# EAGLE design main_board (EAGLE 9.2.1)

## Sheet 1 of 2: POWER
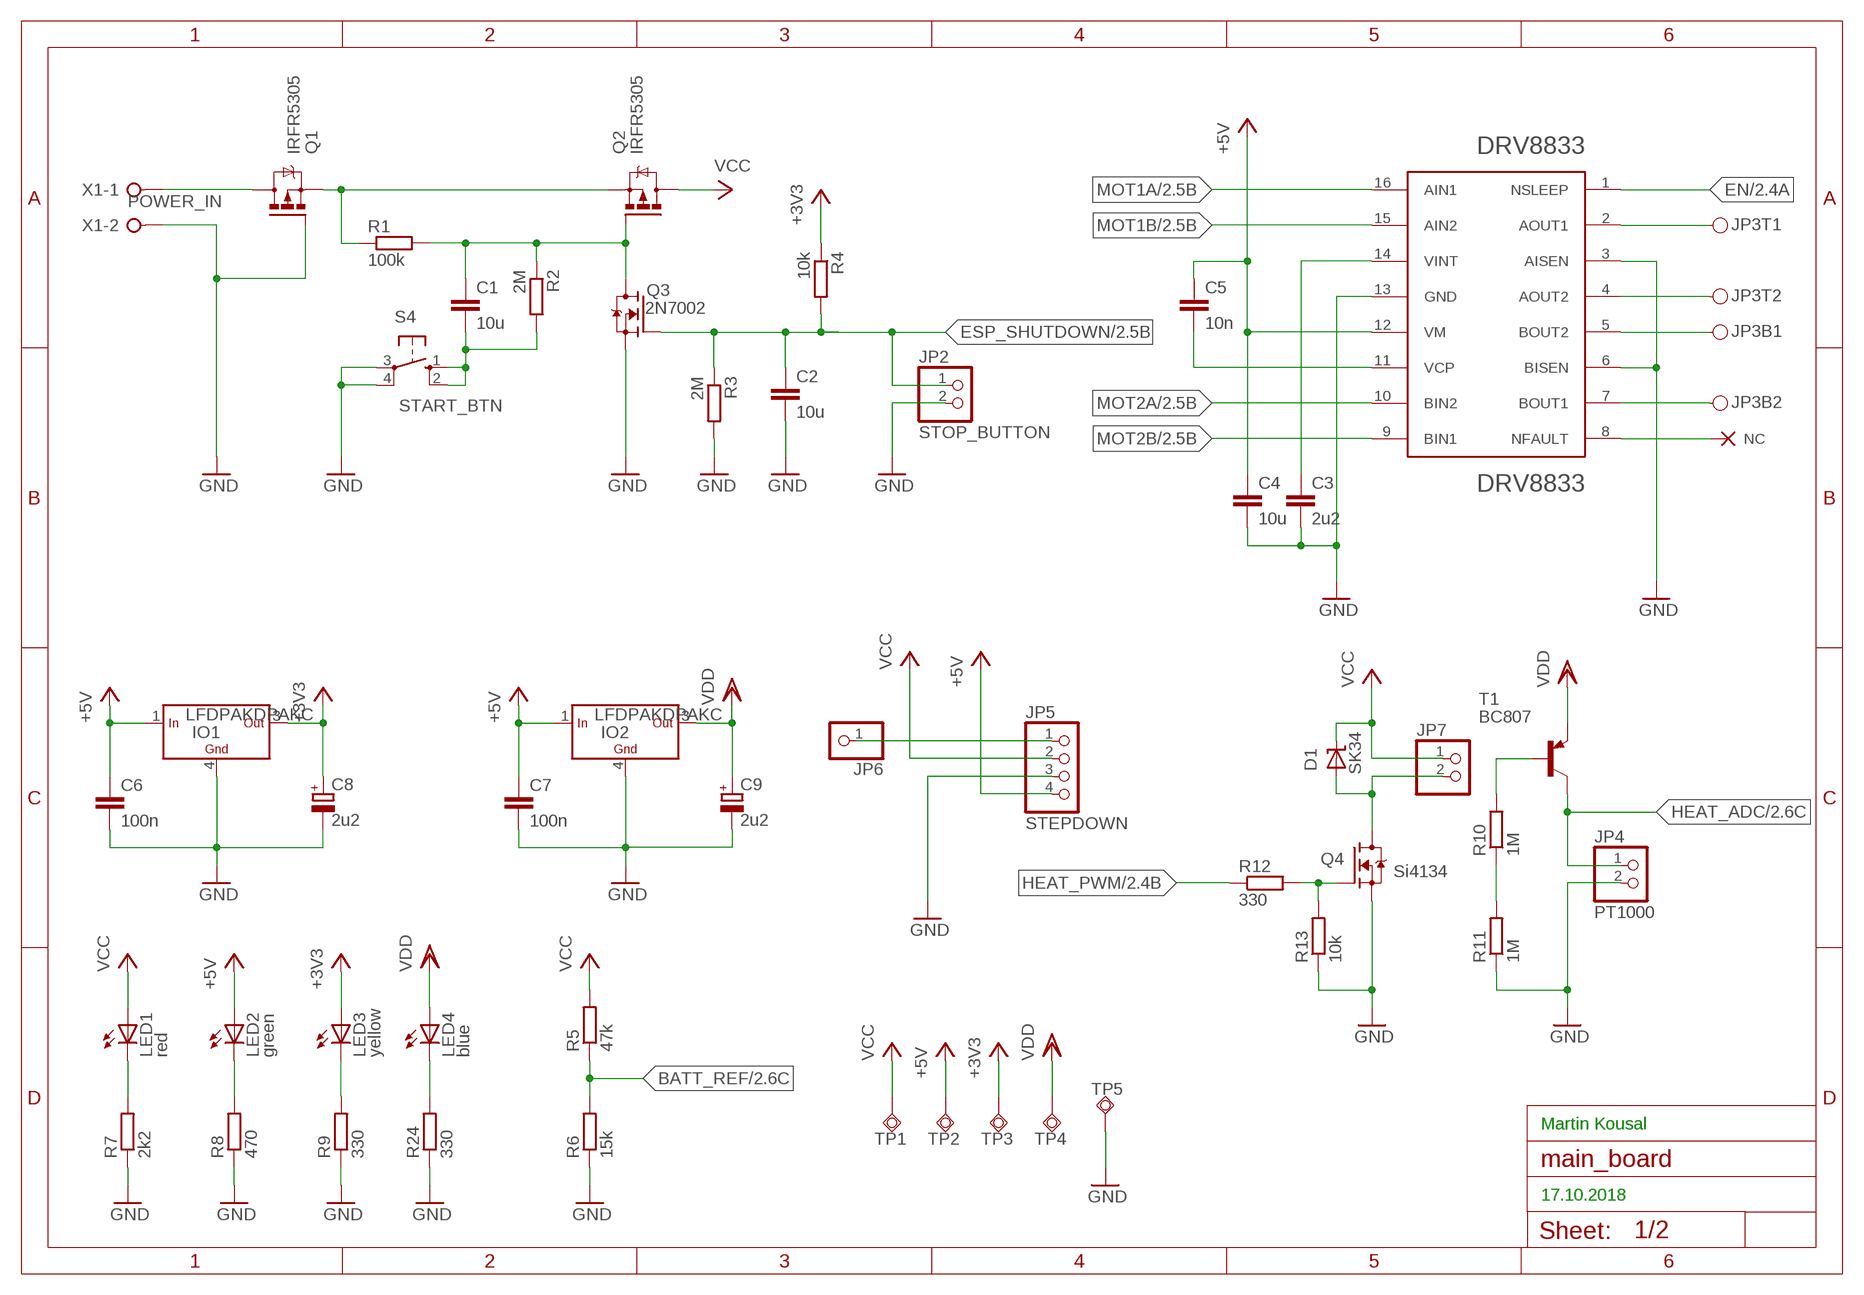
[diagram p0: schematic, sheet 1]

### Parts
C1  10u  C-EUC0805  [C0805]
C2  10u  C-EUC0805  [C0805]
C3  2u2  C-EUC0603  [C0603]
C4  10u  C-EUC1206  [C1206]
C5  10n  C-EUC0603  [C0603]
C6  100n  C-EUC0603  [C0603]
C7  100n  C-EUC0603  [C0603]
C8  2u2  CPOL-EUUD-4X5,8  [UD-4X5,8_NICHICON]
C9  2u2  CPOL-EUUD-4X5,8  [UD-4X5,8_NICHICON]
D1  SK34  SHOTTKY-SMB  [SMB]
DRV8833PWP1  DRV8833  [SOP65P640X120-17N]
IO1  LFDPAKDPAKC  [DPAK]
IO2  LFDPAKDPAKC  [DPAK]
JP2  STOP_BUTTON  PINHD-1X2  [1X02]
JP3  PINH2X02  [PINH2X02SMD]
JP4  PT1000  PINHD-1X2  [1X02]
JP5  STEPDOWN  PINHD-1X4  [1X04]
JP6  PINHD-1X1  [1X01]
JP7  PINHD-1X2  [1X02]
LED1  red  LEDCHIP-LED0603  [CHIP-LED0603]
LED2  green  LEDCHIP-LED0603  [CHIP-LED0603]
LED3  yellow  LEDCHIP-LED0603  [CHIP-LED0603]
LED4  blue  LEDCHIP-LED0603  [CHIP-LED0603]
NC1  NC  (no package)
Q1  IRFR5305  [D-PAK_TO252AA]
Q2  IRFR5305  [D-PAK_TO252AA]
Q3  2N7002  N-MOSFET-SOT23-GSD  [SOT23]
Q4  Si4134  N-MOSFET-SO8  [SO-8]
R1  100k  R-EU_R0603  [R0603]
R2  2M  R-EU_R0603  [R0603]
R3  2M  R-EU_R0603  [R0603]
R4  10k  R-EU_R0603  [R0603]
R5  47k  R-EU_R0603  [R0603]
R6  15k  R-EU_R0603  [R0603]
R7  2k2  R-EU_R0603  [R0603]
R8  470  R-EU_R0603  [R0603]
R9  330  R-EU_R0603  [R0603]
R10  1M  R-EU_R0603  [R0603]
R11  1M  R-EU_R0603  [R0603]
R12  330  R-EU_R0603  [R0603]
R13  10k  R-EU_R0603  [R0603]
R24  330  R-EU_R0603  [R0603]
S4  START_BTN  10-XX  [B3F-10XX]
T1  BC807  BC807-25-PNP-SOT23-BEC  [SOT23-BEC]
TP1  TPSQTP20SQ  [TP20SQ]
TP2  TPSQTP20SQ  [TP20SQ]
TP3  TPSQTP20SQ  [TP20SQ]
TP4  TPSQTP20SQ  [TP20SQ]
TP5  TPSQTP20SQ  [TP20SQ]
X1  POWER_IN  W237-02P  [W237-132]

### Nets
+3V3: C8.+ IO1.3(OUT) LED3.A R4.1 TP3.TP ; also sheet 2
+5V: C4.1 C5.1 C6.1 C7.1 DRV8833PWP1.12(VM) IO1.1(IN) IO2.1(IN) JP5.4 LED2.A TP2.TP
BATT_REF: R5.1 R6.2 ; also sheet 2
EN: DRV8833PWP1.1(NSLEEP) ; also sheet 2
ESP_SHUTDOWN: C2.1 JP2.1 Q3.1(G) R3.1 R4.2 ; also sheet 2
GND: C2.2 C3.2 C4.2 C6.2 C7.2 C8.- C9.- DRV8833PWP1.3(AISEN) DRV8833PWP1.6(BISEN) DRV8833PWP1.13(GND) IO1.4(GND) IO2.4(GND) JP2.2 JP4.2 JP5.3 Q1.1(G) Q3.2(S) Q4.1(S) Q4.2(S) Q4.3(S) R3.2 R6.1 R7.1 R8.1 R9.1 R11.1 R13.1 R24.1 S4.3(P) S4.4(P1) TP5.TP X1.2 ; also sheet 2
HEAT_ADC: JP4.1 T1.C ; also sheet 2
HEAT_PWM: R12.1 ; also sheet 2
MOT1A: DRV8833PWP1.16(AIN1) ; also sheet 2
MOT1B: DRV8833PWP1.15(AIN2) ; also sheet 2
MOT2A: DRV8833PWP1.10(BIN2) ; also sheet 2
MOT2B: DRV8833PWP1.9(BIN1) ; also sheet 2
N$1: Q1.3(S) Q2.3(S) R1.1
N$2: C1.1 Q2.1(G) Q3.3(D) R1.2 R2.1
N$3: LED4.C R24.2
N$4: Q1.4(D) X1.1
N$5: LED3.C R9.2
N$6: LED2.C R8.2
N$7: LED1.C R7.2
N$8: DRV8833PWP1.2(AOUT1) JP3.T1
N$9: DRV8833PWP1.4(AOUT2) JP3.T2
N$10: DRV8833PWP1.5(BOUT2) JP3.B1
N$11: DRV8833PWP1.7(BOUT1) JP3.B2
N$13: C3.1 DRV8833PWP1.14(VINT)
N$14: JP5.1 JP6.1
N$15: C5.2 DRV8833PWP1.11(VCP)
N$16: D1.A JP7.2 Q4.5(D) Q4.6(D) Q4.7(D) Q4.8(D)
N$17: DRV8833PWP1.8(NFAULT) NC1.NC
N$18: R10.1 R11.2
N$19: R10.2 T1.B
N$22: Q4.4(G) R12.2 R13.2
N$30: C1.2 R2.2 S4.1(S) S4.2(S1)
VCC: D1.C JP5.2 JP7.1 LED1.A Q2.4(D) R5.2 TP1.TP
VDD: C9.+ IO2.3(OUT) LED4.A T1.E TP4.TP ; also sheet 2

### Notes on the sheet
- Martin Kousal
- 17.10.2018

## Sheet 2 of 2: LOGIC
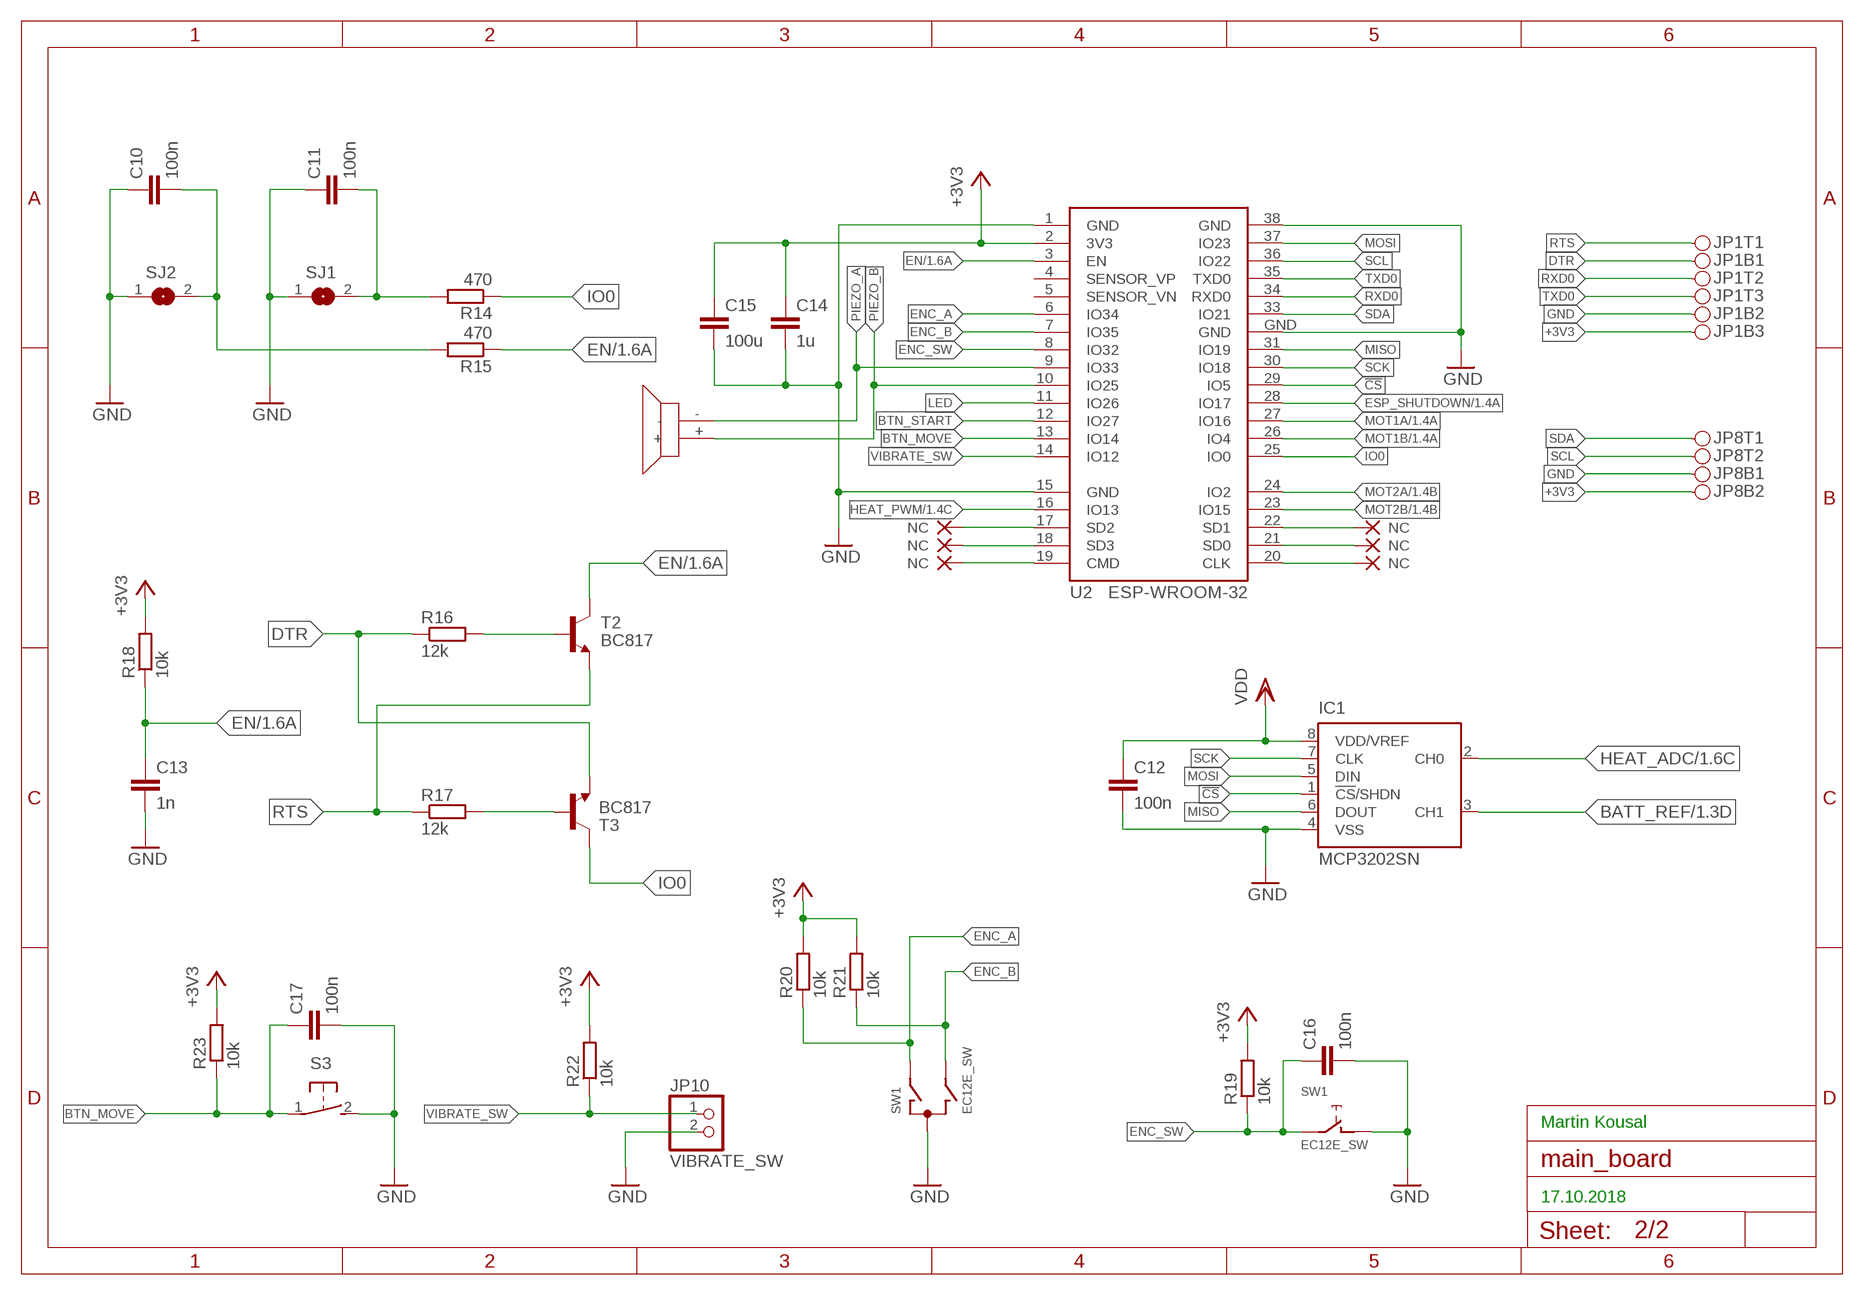
[diagram p1: schematic, sheet 2]

### Parts
C10  100n  C-EUC0603  [C0603]
C11  100n  C-EUC0603  [C0603]
C12  100n  C-EUC0603  [C0603]
C13  1n  C-EUC0603  [C0603]
C14  1u  C-EUC0603  [C0603]
C15  100u  C-EUC0603  [C0603]
C16  100n  C-EUC0603  [C0603]
C17  100n  C-EUC0603  [C0603]
IC1  MCP3202SN  [SO-08]
JP1  PINH2X03  [PINH2X03SMD]
JP8  PINH2X02  [PINH2X02SMD]
JP10  VIBRATE_SW  PINHD-1X2  [1X02]
NC2  NC  (no package)
NC3  NC  (no package)
NC4  NC  (no package)
NC5  NC  (no package)
NC6  NC  (no package)
NC7  NC  (no package)
R14  470  R-EU_R0603  [R0603]
R15  470  R-EU_R0603  [R0603]
R16  12k  R-EU_R0603  [R0603]
R17  12k  R-EU_R0603  [R0603]
R18  10k  R-EU_R0603  [R0603]
R19  10k  R-EU_R0603  [R0603]
R20  10k  R-EU_R0603  [R0603]
R21  10k  R-EU_R0603  [R0603]
R22  10k  R-EU_R0603  [R0603]
R23  10k  R-EU_R0603  [R0603]
S3  31-XX  [B3F-31XX]
SJ1  SJ  [SJ]
SJ2  SJ  [SJ]
SW1  EC12E_SW  [ALPS_EC12E_SW]
T2  BC817  BC817-25-NPN-SOT23-BEC  [SOT23-BEC]
T3  BC817  BC817-25-NPN-SOT23-BEC  [SOT23-BEC]
U2  ESP-WROOM-32  [ESP-WROOM-32]
U$1  PIEZO  [PIEZO]

### Nets
!CS: IC1.1(!CS!/SHDN) U2.29(IO5)
+3V3: C14.1 C15.1 JP1.B3 JP8.B2 R18.2 R19.2 R20.2 R21.2 R22.2 R23.2 U2.2(3V3) ; also sheet 1
BATT_REF: IC1.3(CH1) ; also sheet 1
BTN_MOVE: C17.1 R23.1 S3.1(P) U2.13(IO14)
BTN_START: U2.12(IO27)
DTR: JP1.B1 R16.1 T3.E
EN: C13.1 R15.1 R18.1 T2.C U2.3(EN) ; also sheet 1
ENC_A: R20.1 SW1.A U2.6(IO34)
ENC_B: R21.1 SW1.B U2.7(IO35)
ENC_SW: C16.1 R19.1 SW1.E U2.8(IO32)
ESP_SHUTDOWN: U2.28(IO17) ; also sheet 1
GND: C10.1 C11.1 C12.2 C13.2 C14.2 C15.2 C16.2 C17.2 IC1.4(VSS) JP1.B2 JP8.B1 JP10.2 S3.2(S) SJ1.1 SJ2.1 SW1.C SW1.D U2.1(GND) U2.15(GND) U2.38(GND) U2.GND ; also sheet 1
HEAT_ADC: IC1.2(CH0) ; also sheet 1
HEAT_PWM: U2.16(IO13) ; also sheet 1
IO0: R14.1 T3.C U2.25(IO0)
LED: U2.11(IO26)
MISO: IC1.6(DOUT) U2.31(IO19)
MOSI: IC1.5(DIN) U2.37(IO23)
MOT1A: U2.27(IO16) ; also sheet 1
MOT1B: U2.26(IO4) ; also sheet 1
MOT2A: U2.24(IO2) ; also sheet 1
MOT2B: U2.23(IO15) ; also sheet 1
N$12: R16.2 T2.B
N$20: C10.2 R15.2 SJ2.2
N$21: R17.2 T3.B
N$23: C11.2 R14.2 SJ1.2
N$24: NC5.NC U2.22(SD1)
N$25: NC2.NC U2.17(SD2)
N$26: NC3.NC U2.18(SD3)
N$27: NC4.NC U2.19(CMD)
N$28: NC6.NC U2.21(SD0)
N$29: NC7.NC U2.20(CLK)
PIEZO_A: U2.9(IO33) U$1.-
PIEZO_B: U2.10(IO25) U$1.+
RTS: JP1.T1 R17.1 T2.E
RXD0: JP1.T2 U2.34(RXD0)
SCK: IC1.7(CLK) U2.30(IO18)
SCL: JP8.T2 U2.36(IO22)
SDA: JP8.T1 U2.33(IO21)
TXD0: JP1.T3 U2.35(TXD0)
VDD: C12.1 IC1.8(VDD/VREF) ; also sheet 1
VIBRATE_SW: JP10.1 R22.1 U2.14(IO12)
Unconnected: SW1.GND1(G) SW1.GND2(G) U2.4(SENSOR_VP) U2.5(SENSOR_VN)

### Notes on the sheet
- Martin Kousal
- 17.10.2018

## Library data of the parts
C1-C7 C10-C17 = rcl_upravena:C-EU: CAPACITOR, European symbol
C8 C9 = rcl_upravena:CPOL-EU: POLARIZED CAPACITOR, European symbol
D1 = diode:SHOTTKY
DRV8833PWP1 = DRV8833PWP:DRV8833
IC1 = microchip:MCP3202: 2.7V Dual Channel 12-Bit A/D Converter with SPI Serial Interface Source: http://ww1.microchip.com/downloads/en/DeviceDoc/21034D.pdf; MF: MICROCHIP; MPN: MCP3202-CI/SN; OC_FARNELL: 1196803; OC_NEWARK: 19C7207
IO1 IO2 = #PaJa_30:LF??C: LF??C - stabilizátory low-drop výstup dle typu 1,25 - 12V
JP1 = pinhead_smd:PINH2X03
JP2 JP4 JP7 JP10 = pinhead:PINHD-1X2: PIN HEADER
JP3 JP8 = pinhead_smd:PINH2X02
JP5 = pinhead:PINHD-1X4: PIN HEADER
JP6 = pinhead:PINHD-1X1: PIN HEADER
LED1-LED4 = led:LED: LED OSRAM: - CHIPLED LG R971, LG N971, LY N971, LG Q971, LY Q971, LO R971, LY R971 LH N974, LH R974 LS Q976, LO Q976, LY Q976 LO Q996 - Hyper CHIPLED LW Q18S LB Q993, LB Q99A, LB R99A - SideLED LS A670, LO A670, LY A670, LG A670, LP A670 LB A673, LV A673, LT A673, LW A673 LH A674 LY A675 LS A676, LA A676, LO A676, LY A676, LW A676 LS A679, LY A679, LG A679 - Hyper Micro SIDELED® LS Y876, LA Y876, LO Y876, LY Y876 LT Y87S - SmartLED LW L88C, LW L88S LB L89C, LB L89S, LG L890 LS L89K, LO L89K, LY L89K LS L896, LA L896, LO L896, LY L896 - TOPLED LS T670, LO T670, LY T670, LG T670, LP T670 LSG T670, LSP T670, LSY T670, LOP T670, LYG T670 LG T671, LOG T671, LSG T671 LB T673, LV T673, LT T673, LW T673 LH T674 LS T676, LA T676, LO T676, LY T676, LB T676, LH T676, LSB T676, LW T676 LB T67C, LV T67C, LT T67C, LS T67K, LO T67K, LY T67K, LW E67C LS E67B, LA E67B, LO E67B, LY E67B, LB E67C, LV E67C, LT E67C LW T67C LS T679, LY T679, LG T679 LS T770, LO T770, LY T770, LG T770, LP T770 LB T773, LV T773, LT T773, LW T773 LH T774 LS E675, LA E675, LY E675, LS T675 LS T776, LA T776, LO T776, LY T776, LB T776 LHGB T686 LT T68C, LB T68C - Hyper Mini TOPLED® LB M676 - Mini TOPLED Santana® LG M470 LS M47K, LO M47K, LY M47K Source: http://www.osram.convergy.de LUXEON: - LUMILED® LXK2-PW12-R00, LXK2-PW12-S00, LXK2-PW14-U00, LXK2-PW14-V00 LXK2-PM12-R00, LXK2-PM12-S00, LXK2-PM14-U00 LXK2-PE12-Q00, LXK2-PE12-R00, LXK2-PE12-S00, LXK2-PE14-T00, LXK2-PE14-U00 LXK2-PB12-K00, LXK2-PB12-L00, LXK2-PB12-M00, LXK2-PB14-N00, LXK2-PB14-P00, LXK2-PB14-Q00 LXK2-PR12-L00, LXK2-PR12-M00, LXK2-PR14-Q00, LXK2-PR14-R00 LXK2-PD12-Q00, LXK2-PD12-R00, LXK2-PD12-S00 LXK2-PH12-R00, LXK2-PH12-S00 LXK2-PL12-P00, LXK2-PL12-Q00, LXK2-PL12-R00 Source: www.luxeon.com KINGBRIGHT: KA-3528ASYC Source: www.kingbright.com
NC1-NC7 = NC:NC: _EXTERNAL_
Q1 Q2 = transistor-power:IRF?5305: HEXFET Power MOSFET Source: http://www.irf.com/product-info/datasheets/data/irfr5305pbf.pdf
Q3 Q4 = transistors:N-MOSFET
R1-R24 = rcl_upravena:R-EU_: RESISTOR, European symbol
S3 = switch-omron:31-XX: OMRON SWITCH; MPN: B3F-3100; OC_FARNELL: 959704; OC_NEWARK: 36M3582
S4 = switch-omron:10-XX: OMRON SWITCH; MPN: B3F-1000; OC_FARNELL: 176432; OC_NEWARK: 36M3542
SJ1 SJ2 = jumper:SJ: SMD solder JUMPER
SW1 = switch-alps:EC12E_SW: ALPS rotary Encoder EC12E series with switch; MPN: EC12E2424407; OC_FARNELL: 1520813; OC_NEWARK: 74M1068
T1 = transistor:*-PNP-: PNP Transistror
T2 T3 = transistor:*-NPN-: NPN Transistror BF959 corrected 2008.03.06
TP1-TP5 = testpad:TPSQ: Test pad
U2 = esp32:ESP-WROOM-32: Espressif Systems ESP-WROOM-32
U$1 = piezo:PIEZO
X1 = con-wago-508:W237-02P: WAGO SREW CLAMP; OC_FARNELL: unknown; OC_NEWARK: unknown

## Board
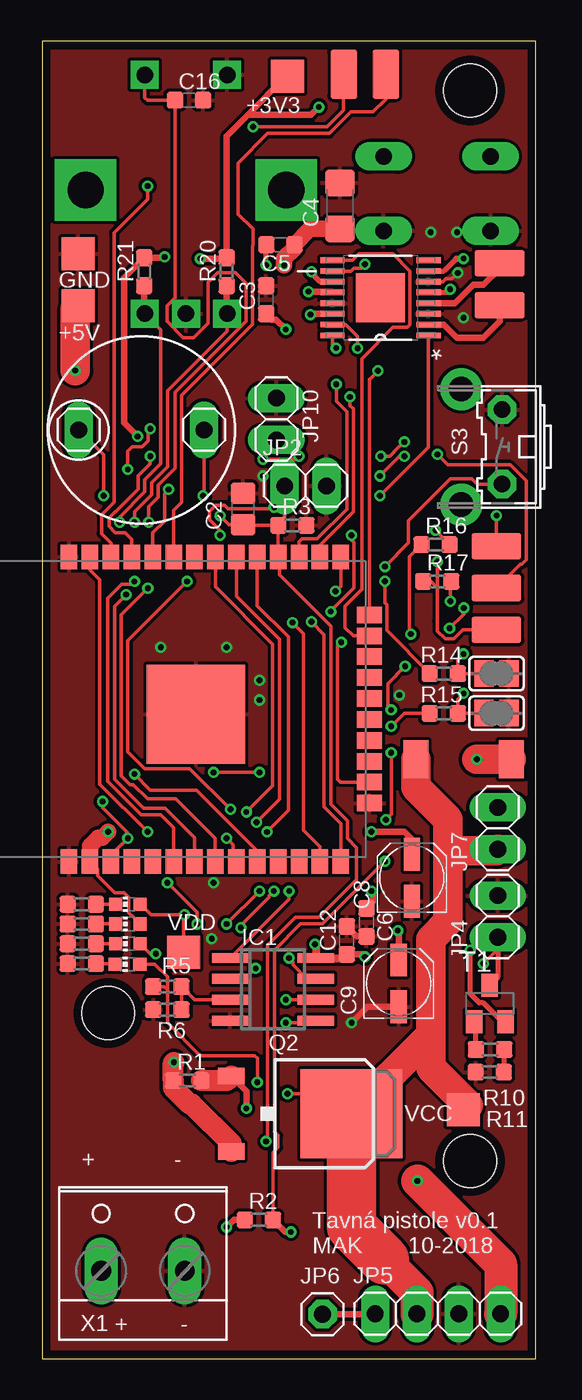
[diagram p2: board, top side]
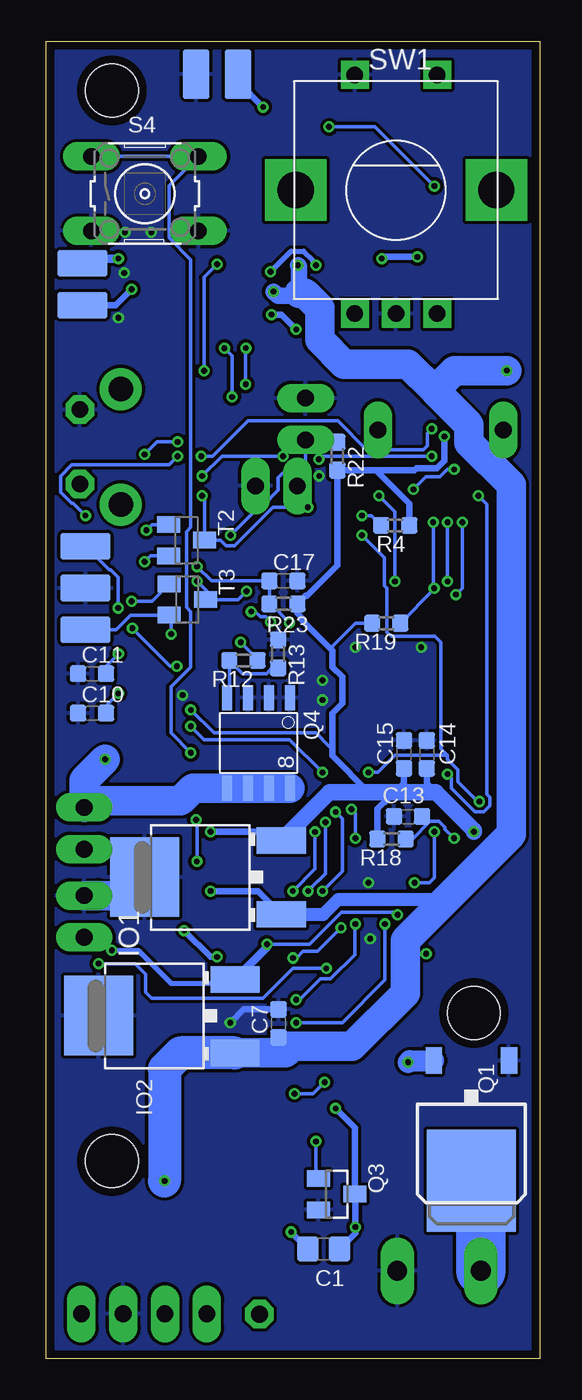
[diagram p3: board, bottom side, seen from below]

Size 30 x 80 mm. Coordinates in mm from the lower left corner, seen from the top.
Outline: 0,0 30,0 30,80 0,80 0,0
Copper layers (1*16): Top 0.035mm / dielectric 1.5mm / Bottom 0.035mm
Design rules "robotikabrno": minimum track width 0.2mm, minimum drill 0.35mm, track to track 0.2mm, track to pad 0.2mm, pad to pad 0.2mm, via to via 0.2mm, smd to smd 0.2mm, copper to edge 0.5mm, drill to drill 0.5mm, minimum pad ring 0.16mm, minimum via ring 0.16mm, stop-mask expansion 0.1mm, vias tented up to drill 0.4mm, thermal gap 0.2mm
Holes 3.2 mm at 26,77 26,12 4,21

### Footprints (pad centres in the part's own frame; a part is rotated, then mirrored left to right if it is on the bottom)
C0805 = smd 1.3 x 1.5: 1 -0.95,0; 2 0.95,0
C0603 = smd 1 x 1: 1 -0.85,0; 2 0.85,0
C1206 = smd 1.6 x 1.8: 1 -1.4,0; 2 1.4,0
UD-4X5,8_NICHICON = smd 2 x 1: + 1.425,0; - -1.425,0
SMB = smd 1.52 x 2.3: A -2.895,0; C 2.895,0
SOP65P640X120-17N = smd 1.473 x 0.356: 1 -2.921,2.286; 2 -2.921,1.626; 3 -2.921,0.965; 4 -2.921,0.33; 5 -2.921,-0.33; 6 -2.921,-0.965; 7 -2.921,-1.626; 8 -2.921,-2.286; 9 2.921,-2.286; 10 2.921,-1.626; 11 2.921,-0.965; 12 2.921,-0.33; 13 2.921,0.33; 14 2.921,0.965; 15 2.921,1.626; 16 2.921,2.286 | smd 2.997 x 2.997: 17 0,0
SO-08 = smd 0.6 x 2.2: 1 -1.905,-2.6; 2 -0.635,-2.6; 3 0.635,-2.6; 4 1.905,-2.6; 5 1.905,2.6; 6 0.635,2.6; 7 -0.635,2.6; 8 -1.905,2.6
DPAK = smd 1.6 x 2.997: 1 -2.261,-4.928; 3 2.21,-4.928 | smd 4.826 x 4.191: 4 0,3.353
PINH2X03SMD = smd 1.6 x 3 bottom: B1 -2.54,-2; B2 0,-2; B3 2.54,-2 | smd 1.6 x 3: T1 -2.54,-2; T2 0,-2; T3 2.54,-2
1X02 = drill 1.016 long: 1 -1.27,0; 2 1.27,0
PINH2X02SMD = smd 1.6 x 3 bottom: B1 -1.27,-2; B2 1.27,-2 | smd 1.6 x 3: T1 -1.27,-2; T2 1.27,-2
1X04 = drill 1.016 long: 1 -3.81,0; 2 -1.27,0; 3 1.27,0; 4 3.81,0
1X01 = drill 1.016 octagon: 1 0,0
CHIP-LED0603 = smd 0.8 x 0.8: A 0,-0.75; C 0,0.75
D-PAK_TO252AA = smd 1 x 1.6: 1 -2.28,-4.8; 3 2.28,-4.8 | smd 5.4 x 6.2: 4 0,2.5
SOT23 = smd 1 x 1.4: 1 -0.95,-1.1; 2 0.95,-1.1; 3 0,1.1
SO-8 = smd 1.524 x 0.61: 1 -2.743,1.905; 2 -2.743,0.635; 3 -2.743,-0.635; 4 -2.743,-1.905; 5 2.743,-1.905; 6 2.743,-0.635; 7 2.743,0.635; 8 2.743,1.905
R0603 = smd 1 x 1: 1 -0.85,0; 2 0.85,0
B3F-31XX = drill 1.016 octagon: 1 -2.261,-1.245; 2 2.261,-1.245 | drill 1.499 pad 2.159: 3 -3.505,1.245; 4 3.505,1.245
B3F-10XX = drill 1.016 long: 1 -3.251,2.261; 2 3.251,2.261; 3 -3.251,-2.261; 4 3.251,-2.261
SJ = smd 1.168 x 1.6: 1 -0.762,0; 2 0.762,0
ALPS_EC12E_SW = drill 1 square: A -2.5,-7.5; B 2.5,-7.5; C 0,-7.5; D -2.5,7; E 2.5,7 | drill 2.2 square: GND1 -6.1,0; GND2 6.1,0
SOT23-BEC = smd 1 x 1.4: B -0.95,-1.1; C 0,1.1; E 0.95,-1.1
TP20SQ = smd 2 x 2: TP 0,0
ESP-WROOM-32 = smd 1.5 x 1: 1 -9.25,7; 2 -9.25,5.73; 3 -9.25,4.46; 4 -9.25,3.19; 5 -9.25,1.92; 6 -9.25,0.65; 7 -9.25,-0.62; 8 -9.25,-1.89; 9 -9.25,-3.16; 10 -9.25,-4.43; 11 -9.25,-5.7; 12 -9.25,-6.97; 13 -9.25,-8.24; 14 -9.25,-9.51; 25 9.25,-9.51; 26 9.25,-8.24; 27 9.25,-6.97; 28 9.25,-5.7; 29 9.25,-4.43; 30 9.25,-3.16; 31 9.25,-1.89; 32 9.25,-0.62; 33 9.25,0.65; 34 9.25,1.92; 35 9.25,3.19; 36 9.25,4.46; 37 9.25,5.73; 38 9.25,7 | smd 1 x 1.5: 15 -5.7,-11.25; 16 -4.43,-11.25; 17 -3.16,-11.25; 18 -1.89,-11.25; 19 -0.62,-11.25; 20 0.65,-11.25; 21 1.92,-11.25; 22 3.19,-11.25; 23 4.46,-11.25; 24 5.73,-11.25 | smd 6 x 6: GND -0.3,-0.7
PIEZO = drill 1.016 long: + 1.27,8.89; - 1.27,1.27
W237-132 = drill 1.194 long: 1 -2.54,-0.635; 2 2.54,-0.635

### Placement (x,y rotation side)
C1  13.12,6.66 180 bottom
C2  12.2,51.6 90 top
C3  13.6,64.3 90 top
C4  18.09,70 90 top
C5  14.47,67.64 180 top
C6  19.7,26.5 270 top
C7  15.87,20.36 90 bottom
C8  22.46,29.21 90 top
C9  21.66,22.79 90 top
C10  27.2,39.2 0 bottom
C11  27.2,41.6 0 bottom
C12  18.5,25.4 90 top
C13  8,32.93 180 bottom
C14  6.86,36.7 90 bottom
C15  8.25,36.7 90 bottom
C16  8.92,76.42 0 top
C17  15.57,47.23 0 bottom
D1  25.6,36.4 180 top
DRV8833PWP1  20.55,64.42 180 top
IC1  14.02,22.43 270 top
IO1  LFDPAK?C  [DPAK]  20.64,29.25 90 bottom
IO2  LFDPAK?C  [DPAK]  23.44,20.83 90 bottom
JP1  25.6,46.8 90 top
JP2  16,53 0 top
JP3  25.79,65.24 90 top
JP4  27.68,26.86 90 top
JP5  24.04,2.73 0 top
JP6  17.03,2.71 0 top
JP7  27.68,32.21 90 top
JP8  19.6,76 180 top
JP10  14.23,57.06 90 top
LED1  5.18,23.96 90 top
LED2  5.2,25.2 90 top
LED3  5.2,26.4 90 top
LED4  5.2,27.6 90 top
Q1  4.15,13.31 180 bottom
Q2  16.29,14.88 270 top
Q3  12.33,10 270 bottom
Q4  17.08,37.39 270 bottom
R1  8.81,16.89 0 top
R2  13.16,8.44 0 top
R3  15.2,50.6 0 top
R4  8.78,50.6 180 bottom
R5  7.6,22.6 180 top
R6  7.6,21.2 0 top
R7  2.4,24 0 top
R8  2.4,25.2 0 top
R9  2.4,26.4 0 top
R10  27.21,18.78 180 top
R11  27.19,17.41 0 top
R12  18,42.4 180 bottom
R13  15.9,42.8 270 bottom
R14  24.4,41.6 0 top
R15  24.4,39.19 0 top
R16  23.9,49.44 0 top
R17  24,47.2 0 top
R18  9,31.56 180 bottom
R19  9.32,44.66 180 bottom
R20  11.2,66 90 top
R21  6.2,66 90 top
R22  12.3,54.8 270 bottom
R23  15.57,45.84 0 bottom
R24  2.4,27.6 0 top
S3  26.7,55.37 90 top
S4  23.99,70.74 0 bottom
SJ1  27.6,41.6 180 top
SJ2  27.6,39.2 180 top
SW1  8.73,70.96 0 bottom
T1  27.19,21.57 0 top
T2  21.46,49.7 270 bottom
T3  21.41,46.1 270 bottom
TP1  25.59,15.12 0 top
TP2  2.19,63.94 0 top
TP3  14.89,77.86 0 top
TP4  8.59,24.68 0 top
TP5  2.19,67.1 0 top
U2  8.63,39.44 90 top
U$1  11.1,55.13 90 top
X1  6.12,5.98 0 top

### Tracks (layer width: path | path; a pad name or v marks a point on that pad's centre or on a via)
!CS  (via drill 0.35)
  Top 0.2: U2.29 13.06,45.74 14.95,43.84 14.95,33.29 v13.65,31.99 | v15,28.4 15,27.91 IC1.1
  Bottom 0.2: v13.65,31.99 13.65,29.75 v15,28.4
+3V3  (via drill 0.35)
  Top 0.2: U2.2 3.37,29.72 3.37,29.32 4.39,28.3 4.97,28.3 5.25,28.02 5.25,27.08 5.43,26.9 5.45,26.9 LED3.A | v25.61,45.59 25.61,45.22 v24.75,44.35 | v22.05,42.05 21,41 21,39.6 v21.2,39.4
  Top 0.4: C8.+ 22.46,31.54 22,32 v20,32 | v5.8,56 4.98,56.82 4.98,65.63 R21.2 7.38,66.85 v7.43,66.9 | v9.6,66.8 11.15,66.8 R20.2 11.2,74.24 12.5,75.53 | v16.8,76 16.34,75.53 12.5,75.53 | 12.5,75.53 14.82,77.86 TP3.TP
  Top 1: v4,32 3.64,31.64 3.38,31.64 2.9,31.16 U2.2
  Bottom 0.2: 8.8,34.4 9.2,34 | R19.2 11.2,44.66 12.6,43.26 12.6,43 | JP1.B3 26.16,47.9 26.07,47.9 25.61,47.45 v25.61,45.59 | v24.75,44.35 22.45,42.05 v22.05,42.05 | v21.2,39.4 19.8,38 13.6,38 12.8,37.2 12.6,37.2
  Bottom 0.4: IO1.3 16.25,32 v20,32 | 9.2,34 9.37,33.83 9.43,33.83 9.85,33.41 R18.2 | 6.3,34.4 6.86,34.96 C14.1 | 8.8,34.4 8.25,34.95 C15.1 | 9.95,53.95 R22.2 12.3,48.17 14.14,46.33 14.23,46.33 R23.2 14.72,45.26 14.46,45 14.46,44.87 12.6,43 12.6,42 12,41.4 12,39.8 12.6,39.2 12.6,37.2 12.6,36.6 10.4,34.4 | R4.1 7.93,51.93 9.95,53.95 | 9.95,53.95 7.6,53.95 7.49,54.06 6.26,54.06 5.8,54.53 v5.8,56 | v7.43,66.9 9.5,66.9 v9.6,66.8 | v16.8,76 18.33,77.53 JP8.B2
  Bottom 1: IO1.3 12.77,34.4 10.4,34.4 8.8,34.4 6.3,34.4 4,32.1 v4,32
+5V  (via drill 0.35)
  Top 0.2: v6.9,24.6 6.55,24.6 LED2.A
  Top 0.4: DRV8833PWP1.12 17.58,64.8 v16.18,64.8 | v20,28.4 20.1,28.3 20.1,27.75 C6.1
  Top 1: C4.1 16.28,68.6 C5.1 15.32,67.44 14.7,66.82 v14.7,66.4
  Top 1.8: v2,60 2,63.75 TP2.TP
  Top 2: v22.8,10.8 27.85,5.75 JP5.4
  Bottom 0.2: 8.16,25.41 7.36,24.6 v6.9,24.6
  Bottom 0.4: IO1.1 17.12,28.4 v20,28.4 | C7.1 15.87,19.44 15.39,18.96
  Bottom 0.8: IO1.1 13.15,26.99 12.24,27.9 5.67,27.9 5.18,28.39
  Bottom 1: v16.18,64.8 15.91,64.53 14.63,64.53 14.63,64.7 14.63,66.33 v14.7,66.4
  Bottom 1.8: IO2.1 15.46,18.57 15.06,18.96 | 15.06,18.96 11.41,18.96 8.16,22.21 8.16,25.41 5.18,28.39 1.73,31.84 1.73,53.06 4.3,55.63 4.3,56.7 6.4,58.8 | 6.4,58.8 8,60.4 11.9,60.4 13.37,61.87 13.37,63.79 14.27,64.7 14.63,64.7 | 15.06,18.96 15.39,18.96 | 6.4,58.8 5.2,60 v2,60
  Bottom 2: IO2.1 21.83,18.57 22.8,17.6 v22.8,10.8
BATT_REF
  Top 0.2: R6.2 R5.1 9.26,21.8 IC1.3
BTN_MOVE  (via drill 0.35)
  Top 0.2: v15.2,44.7 15.87,44.03 15.87,32.09 16.87,31.09 U2.13 | v20.82,48.1 22.25,49.53 22.25,50.88 24.8,53.44 26.11,53.44 26.44,53.11 S3.1
  Bottom 0.2: v20.82,48.1 19.95,47.23 C17.1 R23.1 16.34,45.84 v15.2,44.7
DTR  (via drill 0.35 pad 0.2)
  Top 0.2: v22.4,44 22.3,44.1 22.3,46.78 22.3,48.69 R16.1
  Bottom 0.2: JP1.B1 25.74,44.26 24.85,45.15 T3.E 22.4,45.04 v22.4,44
EN  (via drill 0.35)
  Top 0.2: U2.3 4.17,30.59 4.82,31.24 4.84,31.24 v5.2,31.6 5.2,31.93 3.67,33.47 v3.67,33.84 | DRV8833PWP1.1 23.47,55.36 v20.52,52.4 | v10.8,50 10.8,50.3 10.16,50.94 10.16,51.46 10.54,51.84 11.06,51.84 11.3,51.6 13.99,51.6 v14.09,51.7 | R15.1 21.99,39.19 v21.2,38.4 | v13.2,35.6 v10.4,35.6
  Bottom 0.2: R18.1 7.74,31.56 6.66,32.63 | 6.66,32.63 6.14,32.63 5.76,32.26 5.76,32.16 v5.2,31.6 | C13.1 6.86,32.63 6.66,32.63 | v20.52,52.4 20.36,52.24 T2.C 19.39,49.7 19.06,49.37 18.53,49.37 16.2,51.7 v14.09,51.7 | v10.8,50 9.44,48.63 9.44,46.94 9.27,46.77 9.27,44.12 9.01,43.86 6.36,43.86 6,43.5 6,37.05 5.6,36.65 | v21.2,38.4 20.4,37.6 15.2,37.6 v13.2,35.6 | v10.4,35.6 9.84,35.6 8.79,36.65 5.6,36.65 | v3.67,33.84 3.77,33.84 4.96,35.04 4.96,35.76 5.6,36.4 5.6,36.65
ENC_A  (via drill 0.35)
  Top 0.2: v5.6,50.8 5.6,51.43 6.63,52.46 6.63,53.2 7.6,54.17 7.6,58.77 11.23,62.4 SW1.A | v5.6,47.2 5.43,47.03 4.84,47.03 3.96,46.16 3.96,35.07 6,33.03 7.2,33.03 7.98,32.26 U2.6
  Top 0.406: R20.1 11.2,63.49 SW1.A
  Bottom 0.2: v5.6,50.8 v5.6,47.2
ENC_B  (via drill 0.35)
  Top 0.2: v4.7,50.8 4.7,51.1 6.23,52.63 6.23,53.36 7.2,54.33 7.2,62.49 6.2,63.49 | U2.7 9.25,31.65 7.46,33.44 6.17,33.44 4.4,35.2 4.4,45.7 v5.1,46.4
  Top 0.406: R21.1 6.2,63.49 SW1.B
  Bottom 0.2: v4.7,50.8 4.7,46.8 v5.1,46.4
ENC_SW  (via drill 0.35)
  Top 0.2: SW1.E 6.23,76.57 6.4,76.4 6.42,76.42 C16.1 8.07,64.43 7.58,63.94 7.58,62.98 8.56,62 9.2,62 10.08,62.88 10.08,65.37 10.66,65.95 11.74,65.95 12.38,65.31 12.38,62.98 8.07,58.67 8.07,54.07 7.03,53.03 7.03,52.3 6.47,51.74 v6.47,50.8 | v6.42,46.78 4.8,45.17 4.8,35.4 5.34,34.87 5.54,34.87 6.4,34 8.1,34 10.5,31.6 10.5,30.21 U2.8
  Bottom 0.2: v6.47,50.8 6.47,46.84 v6.42,46.78 6.42,46.72 R19.1
ESP_SHUTDOWN  (via drill 0.35)
  Top 0.2: v13.6,13.2 13.7,13.3 13.7,25.1 15.4,26.8 16.8,26.8 19.1,29.1 19.1,31.04 18.54,31.6 18.54,32.66 17.53,33.67 17.53,44.47 14.4,47.6 14.4,48.62 U2.28 14.33,49.67 R3.1 | JP2.1 14.73,50.98 R3.1 | R3.1 12.25,50.6 C2.1 11.35,50.65 v10.8,51.2
  Bottom 0.2: v13.6,13.2 13.6,11.12 Q3.1 | v10.8,51.2 10.23,51.2 R4.2
GND  (via drill 0.35)
  Top 0.2: DRV8833PWP1.6 24.34,65.39 24.52,65.57 24.89,65.57 v25.25,65.93
  Top 0.4: C12.2 19.1,25.65 C6.2 | v18.8,20.4 19.77,21.36 C9.-
  Bottom 0.4: C7.2 17.99,21.21 v18.8,20.4
  Bottom 1.8: IO1.4 25.11,28.13 JP4.2
  other vias: 7.2,43.2 11.2,43.2 13.2,41.2 13.2,40 10.3,25.5 10.4,28.9 23.6,68.4 25.2,68.4 13.4,53.6 25.6,63.2 21.7,40.3
  pour Top: 0,0 0.4,0 30,0 30,80 0,80
  pour Bottom: 0,-0.4 30,-0.4 30,80 0,80
HEAT_ADC  (via drill 0.35)
  Top 0.2: IC1.2 12.33,23.07 v12.97,23.7 | v26.8,24 27.68,24.88 JP4.1
  Top 0.305: JP4.1 27.68,23.16 T1.C
  Bottom 0.2: v26.8,24 24.59,24 23.95,23.35 23.95,22.25 23.58,21.89 16.81,21.89 15,23.7 v12.97,23.7
HEAT_PWM  (via drill 0.35)
  Top 0.2: U2.16 18.12,35.01 17.93,35.2 17.93,43.27 v18.16,43.5
  Bottom 0.2: v18.16,43.5 17.15,42.48 R12.1
IO0  (via drill 0.35)
  Top 0.2: R14.1 20.93,44.22 20.93,45.79 20.82,45.91 v20.82,47.2 | v17.82,46.59 18.14,46.91 U2.25
  Bottom 0.2: v20.82,47.2 20.21,46.6 20.21,46.2 T3.C 18.32,46.1 v17.82,46.59
MISO  (via drill 0.35)
  Top 0.2: U2.31 10.52,46.88 14,43.4 14,34.8 v12.4,33.2 | v13.2,28.4 v11.2,26.4 | v14.8,21.8 IC1.6
  Bottom 0.2: v12.4,33.2 12,32.8 12,29.6 v13.2,28.4 | v11.2,26.4 11.23,26.37 11.23,24.54 12.71,23.07 13.34,23.07 14.6,21.8 v14.8,21.8
MOSI  (via drill 0.35)
  Top 0.2: U2.37 2.9,47.89 3.5,47.29 3.5,34.9 v6.4,32 | v7.6,28.9 9.4,27.1 v9.4,26.4 | v14.8,20.4 16.5,20.4 IC1.5
  Bottom 0.2: v6.4,32 6.4,29.2 6.7,28.9 v7.6,28.9 | v9.4,26.4 9.4,23 12,20.4 v14.8,20.4
MOT1A  (via drill 0.35)
  Top 0.2: v17.87,59.17 17.87,58.14 18.5,57.51 18.5,51.59 16.7,49.79 15.79,49.79 15.6,49.6 U2.27 | v17.85,61.37 17.63,61.59 DRV8833PWP1.16
  Bottom 0.2: v17.87,59.17 17.87,61.35 v17.85,61.37
MOT1B  (via drill 0.35)
  Top 0.2: v19.16,61.36 19.16,62.07 18.44,62.79 DRV8833PWP1.15 | U2.26 16.87,49.39 18.9,51.42 18.9,57.67 18.7,57.87 v18.7,58.4
  Bottom 0.2: v18.7,58.4 18.7,60.9 v19.16,61.36
MOT2A  (via drill 0.35)
  Top 0.2: U2.24 19.88,59.49 19.9,59.49 v20.4,59.99 | DRV8833PWP1.10 18.75,66.05 18.93,66.22 19.36,66.22 v19.6,66.45
  Bottom 0.2: v19.6,66.45 20.4,65.65 v20.4,59.99
MOT2B
  Top 0.2: U2.23 18.9,43.9 18.4,44.4 18.4,45.7 19.43,46.73 19.43,58.8 19.43,58.86 19.43,60.73 21.32,62.62 22.17,62.62 22.35,62.8 22.35,66.04 21.3,67.09 19.23,67.09 18.85,66.71 DRV8833PWP1.9
N$1  (via drill 0.35)
  Top 1.27: v8,18 7.96,17.96 R1.1 7.96,16.46 8.96,15.47 9.08,15.47 11.49,13.06 Q2.3
  Bottom 1.27: v8,18 7.89,18.11 Q1.3
N$2  (via drill 0.35)
  Top 0.4: R2.1 11.64,8.44 v11.2,8 | v12.4,15.2 12.4,16.25 Q2.1
  Top 1.27: Q2.1 11.22,16.89 R1.2
  Bottom 0.4: C1.1 11.2,7.63 v11.2,8 11.2,9.97 Q3.3 11.23,14.03 v12.4,15.2
N$3
  Top 0.2: LED4.C R24.2
N$4
  Bottom 3: X1.1 3.58,10.24 Q1.4
N$5
  Top 0.2: LED3.C R9.2
N$6
  Top 0.2: LED2.C R8.2
N$7
  Top 0.2: LED1.C 4.39,24 R7.2
N$8
  Top 0.4: DRV8833PWP1.2 24.41,62.79 25.2,62 26.8,62 27.79,62.99 JP3.T1
N$9
  Top 0.4: DRV8833PWP1.4 25.08,64.09 26.19,65.2 26.8,65.2 27.79,66.19 JP3.T2
N$10  (via drill 0.35)
  Top 0.3: DRV8833PWP1.5 24.6,64.75 v24.79,64.94
  Bottom 0.4: v24.79,64.94 25.76,63.97 JP3.B1
N$11  (via drill 0.35)
  Top 0.3: 25.15,66.8 24.4,66.05 DRV8833PWP1.7
  Top 0.4: v25.6,66.8 25.15,66.8
  Bottom 0.508: v25.6,66.8 27.5,66.8 JP3.B2
N$12  (via drill 0.35 pad 0.2)
  Top 0.2: v23.9,50.3 R16.2
  Bottom 0.2: T2.B 23.55,50.65 v23.9,50.3
N$13  (via drill 0.35)
  Top 0.4: DRV8833PWP1.14 16.36,63.45 v16.3,63.4 | v14.8,62.5 14.2,63.1 13.95,63.1 C3.1
  Bottom 0.4: v16.3,63.4 15.7,63.4 v14.8,62.5
N$14
  Top 0.406: JP6.1 20.21,2.71 JP5.1
N$15  (via drill 0.35)
  Top 0.3: v16.36,66 16.54,65.81 16.54,65.72 16.88,65.39 DRV8833PWP1.11 | v13.6,66.4 13.6,67.62 C5.2
  Bottom 0.3: v13.6,66.4 13.79,66.58 13.79,66.69 14.35,67.25 15.11,67.25 v16.36,66
N$16  (via drill 0.35)
  Top 1.8: v26.4,36.4 D1.A
  Bottom 1.8: Q4.8 Q4.7 Q4.6 Q4.5 21.05,34.65 21.82,33.88 27.27,33.88 JP7.2 27.68,35.12 v26.4,36.4
N$18
  Top 0.305: R10.1 28.06,17.43 R11.2
N$19
  Top 0.305: R10.2 26.36,20.35 T1.B
N$20  (via drill 0.35)
  Top 0.2: SJ2.2 R15.2 25.25,40.05 v25.6,40.4
  Bottom 0.2: v25.6,40.4 26.35,39.65 C10.2
N$21  (via drill 0.35 pad 0.2)
  Top 0.2: v24.8,46 24.8,47.15 R17.2
  Bottom 0.2: T3.B 23.56,46 v24.8,46
N$22
  Bottom 0.2: Q4.4 18.85,40.27 R12.2 18.05,41.6 16.61,41.6 16.26,41.95 R13.2
N$23  (via drill 0.35)
  Top 0.2: SJ1.2 R14.2 25.25,42.45 v25.6,42.8
  Bottom 0.2: v25.6,42.8 26.35,42.05 C11.2
N$30  (via drill 0.35)
  Top 0.2: R2.2 14.01,12.52 14.33,12.84 14.33,13.56 14.11,13.78 14.11,24.81 15.7,26.4 17.03,26.4 v20.83,30.2 | v20.88,32.73 21.2,33.05 v21.2,36.8
  Top 0.4: v15.1,7.7 14.75,7.7 R2.2
  Bottom 0.2: S4.1 S4.2 22.52,71.22 22.52,68.06 21.2,66.74 21.2,50.48 21.46,50.22 21.46,45.63 21.2,45.37 21.2,42 22.4,40.8 22.4,38 v21.2,36.8 | v20.88,32.73 20.83,32.68 v20.83,30.2
  Bottom 0.4: C1.2 v15.11,7.7 v15.1,7.7
PIEZO_A  (via drill 0.35)
  Top 0.2: U$1.- 9.83,52.46 v9.77,52.4 | v8.8,47.2 5.2,43.6 5.2,36.85 6.21,35.84 8.96,35.84 v11.44,33.37 | v11.2,31.6 11.6,31.2 11.6,30.78 11.72,30.66 11.72,30.26 U2.9
  Bottom 0.2: v9.77,52.4 8.8,51.43 v8.8,47.2 | v11.44,33.37 11.2,33.13 v11.2,31.6
PIEZO_B  (via drill 0.35)
  Top 0.2: v5.6,35.5 6.57,34.53 9.37,34.53 13.06,30.84 U2.10 | U$1.+ 3.73,54.88 v3.73,52.4
  Bottom 0.2: v5.6,35.5 5.37,35.27 5.37,34.64 3.93,33.2 3.4,33.2 3.03,33.57 3.03,34.1 3.2,34.27 3.2,51.87 v3.73,52.4
RTS  (via drill 0.35)
  Top 0.2: v24,48.4 24,46.8 | 24,46.8 24,44.8 24.02,44.78 24.02,44.19 24.49,43.72 25.01,43.72 25.56,44.26 JP1.T1 | R17.1 23.6,47.2 24,46.8
  Bottom 0.2: T2.E 23.65,48.75 v24,48.4
RXD0  (via drill 0.35)
  Top 0.2: JP1.T2 29.04,48.24 29.13,48.24 29.4,48.51 29.4,53.3 28.43,54.27 24.64,54.27 v24,54.91 | v20.57,54.8 21.13,54.8 21.36,55.03 21.36,55.06 21.74,55.44 21.77,55.44 v22,55.67 | v7.68,52.78 7.43,52.53 7.43,50.86 6.71,50.14 U2.34 | v5.2,54 5.2,55.1 5.46,55.37 6.06,55.37 6.43,55.74 6.43,56.34 v6.57,56.47
  Bottom 0.2: v24,54.91 23.24,55.67 v22,55.67 | v20.57,54.8 19.88,54.8 17.73,56.95 12.27,56.95 10.51,55.2 7.06,55.2 6.83,55.44 6.83,56.2 v6.57,56.47 | v5.2,54 5.62,54 6.05,53.56 6.9,53.56 v7.68,52.78
SCK  (via drill 0.35)
  Top 0.2: U2.30 11.79,46.31 14.4,43.7 14.4,33.97 v13.02,32.59 | v14.07,28.4 13.77,28.1 13.77,28.04 12.06,26.33 v12.06,26.17 | v14.98,24.34 15.22,24.1 15.22,23.91 16.07,23.07 IC1.7
  Bottom 0.2: v13.02,32.59 13.02,29.45 13.44,29.04 13.46,29.04 13.84,28.66 13.84,28.64 v14.07,28.4 | v12.06,26.17 13.5,24.73 14.38,24.73 14.79,24.34 v14.98,24.34
SCL  (via drill 0.35)
  Top 0.2: U2.36 4.17,49.53 3.6,50.1 3.6,51.23 4.37,52 4.37,68.36 6.4,70.4 v6.4,71.2 | v12.8,74.8 17.3,74.8 18.3,75.8 18.3,77.97 JP8.T2
  Bottom 0.2: v6.4,71.2 10,74.8 v12.8,74.8
SDA
  Top 0.2: U2.33 7.98,51.51 8.47,52 8.47,58.51 12.78,62.82 12.78,67.58 12.8,67.6 12.8,68.6 11.9,69.5 11.9,72.6 13.7,74.4 17.47,74.4 18.77,75.7 20.1,75.7 20.87,76.47 JP8.T1
TXD0  (via drill 0.35)
  Top 0.2: v6.57,54.8 6.57,54.34 5.83,53.6 5.83,53.2 5.83,53.13 5.83,52.8 4.46,51.44 4.44,51.44 4.07,51.06 4.07,50.54 4.44,50.16 5.04,50.16 5.44,49.76 U2.35 | v13.42,54.62 15.42,54.62 v15.6,54.8 | v20.52,53.6 21.71,54.8 v22,54.8 | v27.6,51.2 JP1.T3
  Bottom 0.2: v6.57,54.8 13.24,54.8 v13.42,54.62 | v15.6,54.8 19.32,54.8 v20.52,53.6 | v22,54.8 22.53,54.27 28.43,54.27 29.11,53.59 29.11,52.63 28.43,51.95 28.35,51.95 v27.6,51.2
VCC  (via drill 0.35)
  Top 0.2: 7.6,22.4 7.6,20.4 9.6,18.4 12.9,18.4 13.06,18.23 v13.06,16.8 | 7.6,22.4 7.6,23.2 6.84,23.96 LED1.A | R5.2 7.4,22.6 7.6,22.4 | v14.9,16.1 16.2,16.1 17.42,14.88 Q2.4
  Top 1.8: Q2.4 23.6,19.69 | 24.66,30.02 24.66,26.53 23.6,25.47 23.6,19.69 | JP7.1 27.58,30.84 25.48,30.84 24.66,30.02 | 24.66,30.02 24.66,32.74 22.7,34.7 D1.C | TP1.TP 25.88,15.41 23.6,17.68 23.6,19.69
  Top 2: 20.8,6 22.77,4.03 JP5.2
  Top 3: Q2.4 18.79,8.01 20.8,6
  Bottom 0.2: v13.06,16.8 13.77,16.1 v14.9,16.1
VDD  (via drill 0.35)
  Top 0.2: 18.29,24.34 C12.1 | LED4.A 6.45,27.1 6.47,27.1 6.61,26.96 v8.64,26.96 8.59,26.92 TP4.TP
  Top 0.305: T1.E 27.94,20.47 26.79,21.62 26.54,21.62 26,22.16 v26,24.8
  Top 0.4: C12.1 19.45,24.55 v19.6,24.4 | v21.6,26 21.66,25.94 C9.+
  Top 0.5: v16.58,25.18 16.62,25.13 IC1.8 18.29,24.34
  Bottom 0.2: v16.58,25.18 13.98,25.18 12.05,27.1 8.7,27.1 8.64,27.04 v8.64,26.96
  Bottom 0.305: IO2.3 18.75,22.8 22.4,22.8 24.4,24.8 v26,24.8
  Bottom 0.4: v19.6,24.4 20,24.4 v21.6,26
  Bottom 0.5: IO2.3 16.58,24.98 v16.58,25.18
VIBRATE_SW  (via drill 0.35)
  Top 0.2: U2.14 18.14,32.49 17.13,33.5 17.13,43.97 v16.35,44.75 | v17.53,45.37 17.53,45.41 18.94,46.82 18.94,49.56 18.79,49.71 v18.79,50
  Bottom 0.2: v16.35,44.75 16.64,45.04 16.96,45.04 17.29,45.37 v17.53,45.37 | JP10.1 14.23,55.6 14.23,54.56 14.63,54.16 15.21,54.16 15.89,53.48 15.89,52.73 16.79,51.84 16.96,51.84 v18.79,50
  Bottom 0.4: R22.1 14.18,55.65 14.23,55.6

### Text on the board
tNames: +3V3 | GND | +5V | VDD | VCC | + | - | Tavná pistole v0.1 / MAK 10-2018 | + | -